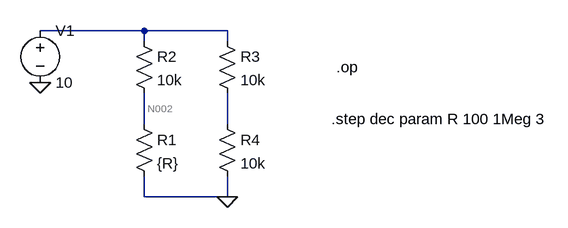
[diagram p0: schematic Draft2.asc]
Draft2.asc, the LTspice schematic file:
Version 4
SHEET 1 880 680
WIRE 112 0 -48 0
WIRE 240 0 112 0
WIRE 112 16 112 0
WIRE 240 16 240 0
WIRE 112 144 112 96
WIRE 240 144 240 96
WIRE 112 256 112 224
WIRE 240 256 240 224
WIRE 240 256 112 256
FLAG -48 80 0
FLAG 240 256 0
SYMBOL res 96 128 R0
SYMATTR InstName R1
SYMATTR Value {R}
SYMBOL res 96 0 R0
SYMATTR InstName R2
SYMATTR Value 10k
SYMBOL res 224 0 R0
SYMATTR InstName R3
SYMATTR Value 10k
SYMBOL res 224 128 R0
SYMATTR InstName R4
SYMATTR Value 10k
SYMBOL voltage -48 -16 R0
WINDOW 123 0 0 Left 0
WINDOW 39 0 0 Left 0
SYMATTR InstName V1
SYMATTR Value 10
TEXT 408 56 Left 2 !.op
TEXT 400 136 Left 2 !.step dec param R 100 1Meg 3

The netlist it stands for:
* Draft2.asc
R1 N002 0 {R}
R2 N001 N002 10k
R3 N001 N003 10k
R4 N003 0 10k
V1 N001 0 10
.op
.step dec param R 100 1Meg 3
.backanno
.end

* Results of the author's LTspice run, read from the files saved beside the schematic
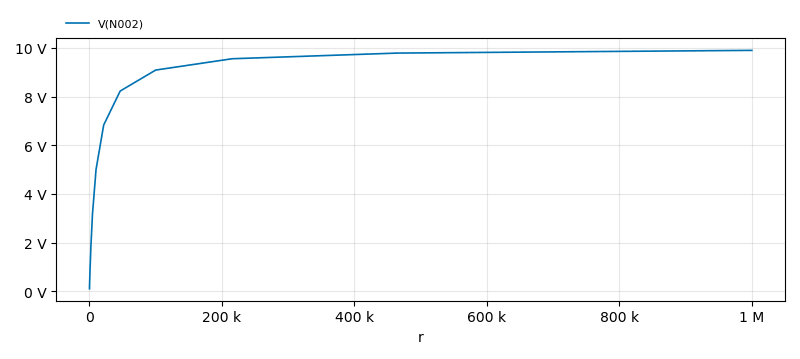
[diagram p1: Operating Point of Draft2.asc, plotted from the saved traces]
* Operating Point, 1 run:
*   V(N002): 99.01 mV at r=100 , 9.901 V at r=1 M, min 99.01 mV, max 9.901 V